# EAGLE design wiring_bord (EAGLE 9.5.2)
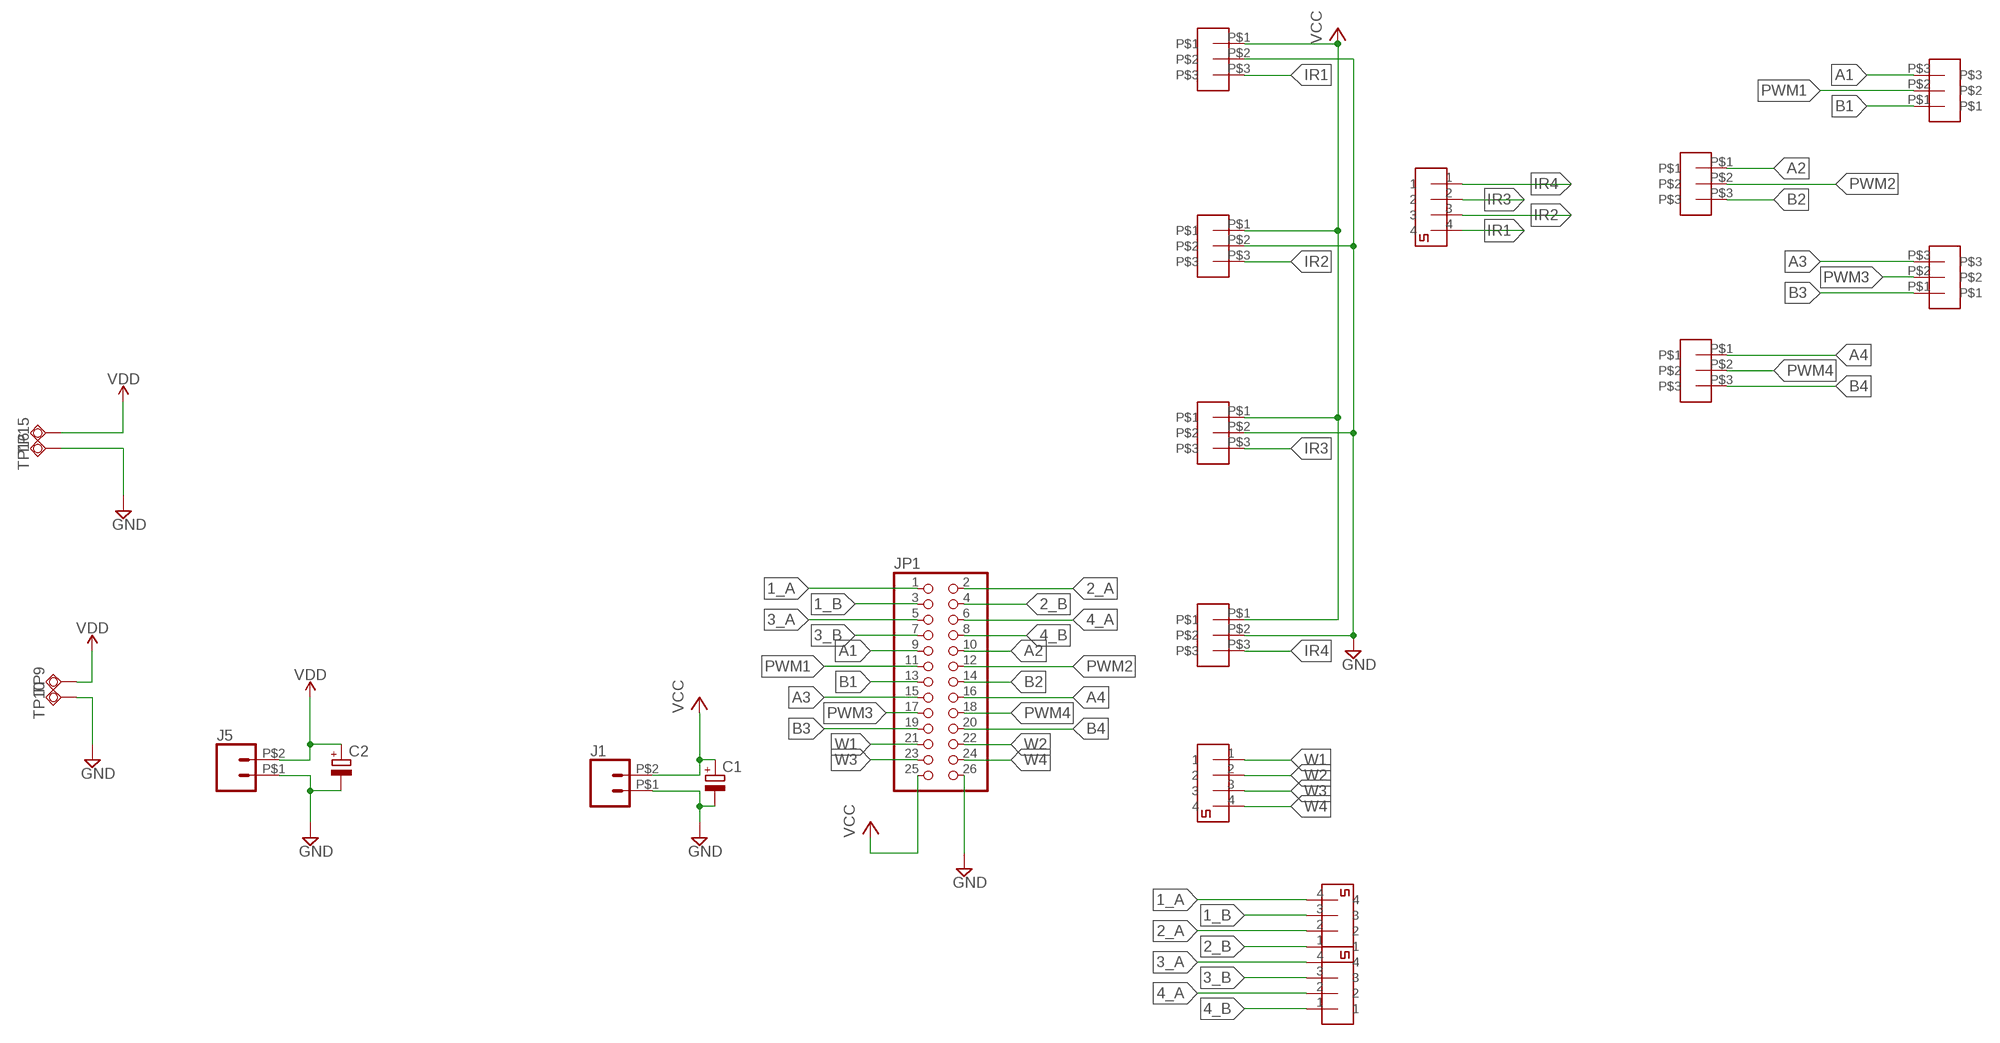
[diagram p0: schematic, sheet 1]

## Parts
C1  CPOL-EUE2-5  [E2-5]
C2  CPOL-EUE2-5  [E2-5]
CONNECTOR1  2PIN  [2PIN]
CONNECTOR2  2PIN  [2PIN]
CONNECTOR3  2PIN  [2PIN]
CONNECTOR4  2PIN  [2PIN]
IR_DISTANCE1  3PIN  [3PIN]
IR_DISTANCE2  3PIN  [3PIN]
IR_DISTANCE3  3PIN  [3PIN]
IR_DISTANCE4  3PIN  [3PIN]
IR_DISTANCE5  3PIN  [3PIN]
IR_DISTANCE6  3PIN  [3PIN]
IR_DISTANCE7  3PIN  [3PIN]
IR_DISTANCE8  3PIN  [3PIN]
J1  CONN_02PTH2  [1X02_BIG]
J5  CONN_02PTH2  [1X02_BIG]
JP1  PINHD-2X13  [2X13]
TP9  TESTPAD_TPSQPAD1-20  [TESTPAD_P1-20]
TP10  TESTPAD_TPSQPAD1-20  [TESTPAD_P1-20]
TP15  TESTPAD_TPSQPAD1-13  [TESTPAD_P1-13]
TP16  TESTPAD_TPSQPAD1-13  [TESTPAD_P1-13]

## Nets
1_A: CONNECTOR3.4 JP1.1
1_B: CONNECTOR3.3 JP1.3
2_A: CONNECTOR3.2 JP1.2
2_B: CONNECTOR3.1 JP1.4
3_A: CONNECTOR4.4 JP1.5
3_B: CONNECTOR4.3 JP1.7
4_A: CONNECTOR4.2 JP1.6
4_B: CONNECTOR4.1 JP1.8
A1: IR_DISTANCE5.P$3 JP1.9
A2: IR_DISTANCE6.P$1 JP1.10
A3: IR_DISTANCE7.P$3 JP1.15
A4: IR_DISTANCE8.P$1 JP1.16
B1: IR_DISTANCE5.P$1 JP1.13
B2: IR_DISTANCE6.P$3 JP1.14
B3: IR_DISTANCE7.P$1 JP1.19
B4: IR_DISTANCE8.P$3 JP1.20
GND: C1.- C2.- IR_DISTANCE1.P$2 IR_DISTANCE2.P$2 IR_DISTANCE3.P$2 IR_DISTANCE4.P$2 J1.P$1 J5.P$1 JP1.26 TP10.TP TP16.TP
IR1: CONNECTOR1.4 IR_DISTANCE1.P$3
IR2: CONNECTOR1.3 IR_DISTANCE2.P$3
IR3: CONNECTOR1.2 IR_DISTANCE3.P$3
IR4: CONNECTOR1.1 IR_DISTANCE4.P$3
PWM1: IR_DISTANCE5.P$2 JP1.11
PWM2: IR_DISTANCE6.P$2 JP1.12
PWM3: IR_DISTANCE7.P$2 JP1.17
PWM4: IR_DISTANCE8.P$2 JP1.18
VCC: C1.+ IR_DISTANCE1.P$1 IR_DISTANCE2.P$1 IR_DISTANCE3.P$1 IR_DISTANCE4.P$1 J1.P$2 JP1.25
VDD: C2.+ J5.P$2 TP9.TP TP15.TP
W1: CONNECTOR2.1 JP1.21
W2: CONNECTOR2.2 JP1.22
W3: CONNECTOR2.3 JP1.23
W4: CONNECTOR2.4 JP1.24

## Library data of the parts
C1 C2 = rcl:CPOL-EU: POLARIZED CAPACITOR, European symbol; SPICEPREFIX: C
CONNECTOR1-CONNECTOR4 = 4pin_small:2PIN: 2pin
IR_DISTANCE1-IR_DISTANCE8 = 3PIN_2:3PIN
J1 J5 = SparkFun-Connectors:CONN_02: Multi connection point. Often used as Generic Header-pin footprint for 0.1 inch spaced/style header connections On any of the 0.1 inch spaced packages, you can populate with these: Break Away Headers - Straight <https://www.sparkfun.com/products/116> (PRT-00116) Break Away Male Headers - Right Angle <https://www.sparkfun.com/products/553> (PRT-00553) Female Headers <https://www.sparkfun.com/products/115> (PRT-00115) Break Away Headers - Machine Pin <https://www.sparkfun.com/products/117> (PRT-00117) Break Away Female Headers - Swiss Machine Pin <https://www.sparkfun.com/products/743> (PRT-00743) For SCREWTERMINALS and SPRING TERMINALS visit here: Screw Terimnals on SparkFun.com <https://www.sparkfun.com/search/results?term=Screw+Terminals> (5mm/3.5mm/2.54mm spacing) This device is also useful as a general connection point to wire up your design to another part of your project. Our various solder wires solder well into these plated through hole pads. Hook-Up Wire - Assortment (Stranded, 22 AWG) <https://www.sparkfun.com/products/11375> (PRT-11375) Hook-Up Wire - Assortment (Solid Core, 22 AWG) <https://www.sparkfun.com/products/11367> (PRT-11367) View the entire wire category on our website here <https://www.sparkfun.com/categories/141> Special notes: Molex polarized connector foot print use with: PRT-08233 with associated crimp pins and housings. 2.54_SCREWTERM for use with PRT-10571. 3.5mm Screw Terminal footprints for PRT-08084 5mm Screw Terminal footprints for use with PRT-08432
JP1 = pinhead:PINHD-2X13: PIN HEADER
TP9 TP10 TP15 TP16 = BeagleBone_Blue_R3:TESTPAD_TPSQ: Test pad

## Board
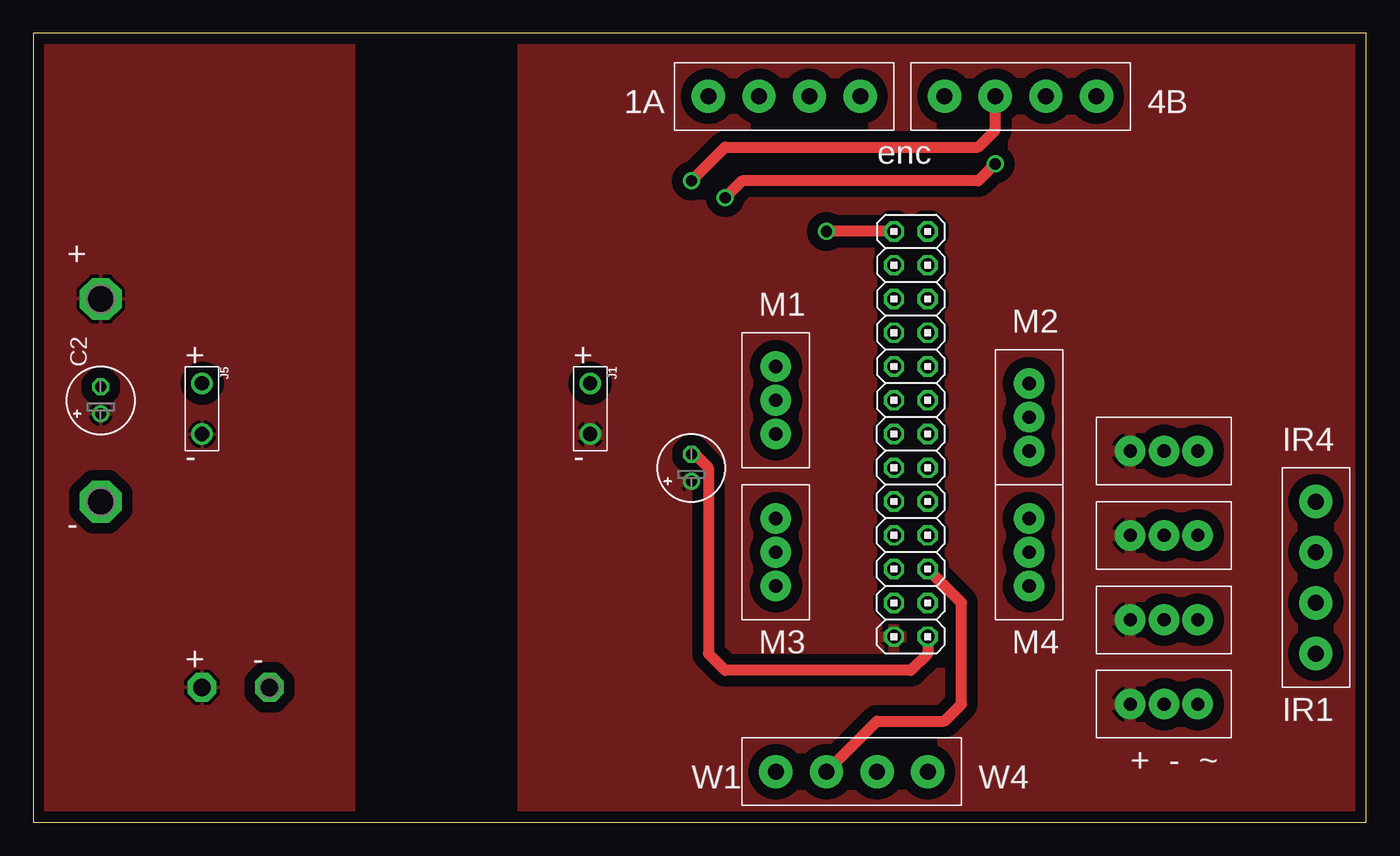
[diagram p1: board, top side]
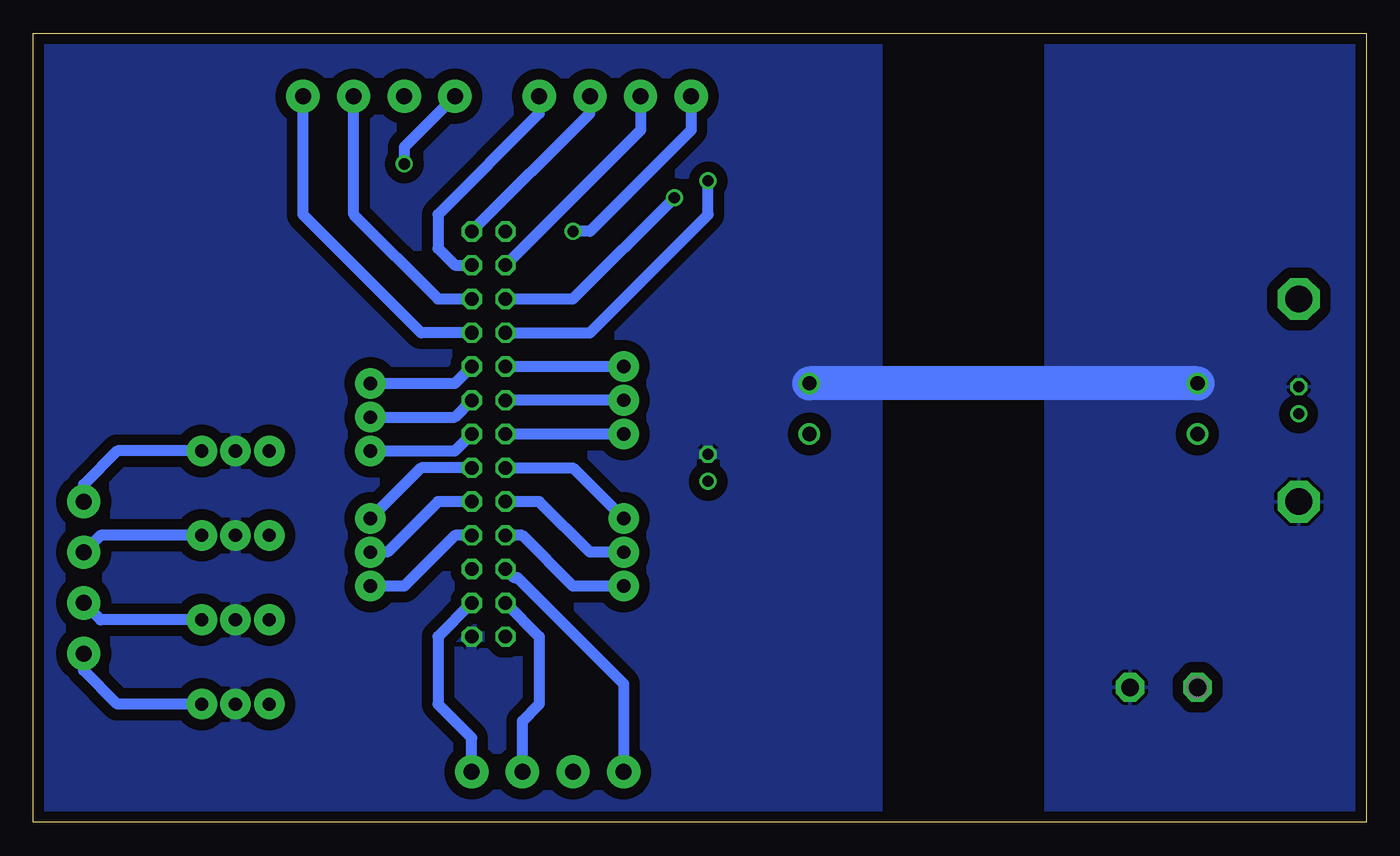
[diagram p2: board, bottom side, seen from below]

Size 100.31 x 59.36 mm. Coordinates in mm from the lower left corner, seen from the top.
Outline: 0,0 100.31,0 100.31,59.36 0,59.36 0,0
Copper layers (1*16): Top 0.035mm / dielectric 1.6mm / Bottom 0.035mm
Design rules "Elecrow_2-layer_PCB_eagle_rule": minimum track width 6mil, minimum drill 12mil, track to track 6mil, track to pad 6mil, pad to pad 6mil, via to via 8mil, smd to smd 0mil, copper to edge 20mil, drill to drill 10mil, minimum pad ring 6mil, minimum via ring 6mil, stop-mask expansion 0mil, vias tented up to drill 100mil, thermal gap 10mil

### Footprints (pad centres in the part's own frame; a part is rotated, then mirrored left to right if it is on the bottom)
E2-5 = drill 0.813 pad 1.27: + -1.016,0 | drill 0.813 pad 1.27 octagon: - 1.016,0
2PIN = drill 1.2 pad 2.5: 1 0,0; 2 3.81,0; 3 7.62,0; 4 11.43,0
3PIN = drill 1 pad 2.3: P$1 0,0; P$2 2.54,0; P$3 5.08,0
1X02_BIG = drill 1.067: P$1 0,0; P$2 3.81,0
2X13 = drill 1.016 octagon: 1 -15.24,-1.27; 2 -15.24,1.27; 3 -12.7,-1.27; 4 -12.7,1.27; 5 -10.16,-1.27; 6 -10.16,1.27; 7 -7.62,-1.27; 8 -7.62,1.27; 9 -5.08,-1.27; 10 -5.08,1.27; 11 -2.54,-1.27; 12 -2.54,1.27; 13 0,-1.27; 14 0,1.27; 15 2.54,-1.27; 16 2.54,1.27; 17 5.08,-1.27; 18 5.08,1.27; 19 7.62,-1.27; 20 7.62,1.27; 21 10.16,-1.27; 22 10.16,1.27; 23 12.7,-1.27; 24 12.7,1.27; 25 15.24,-1.27; 26 15.24,1.27
TESTPAD_P1-20 = drill 2.007 pad 3.15 octagon: TP 0,0
TESTPAD_P1-13 = drill 1.321 pad 2.159 octagon: TP 0,0

### Placement (x,y rotation side)
C1  49.53,26.67 90 top
C2  5.08,31.75 90 top
CONNECTOR1  96.52,12.7 90 top
CONNECTOR2  55.88,3.81 0 top
CONNECTOR3  62.23,54.61 180 top
CONNECTOR4  80.01,54.61 180 top
IR_DISTANCE1  82.55,27.94 0 top
IR_DISTANCE2  82.55,21.59 0 top
IR_DISTANCE3  82.55,15.24 0 top
IR_DISTANCE4  82.55,8.89 0 top
IR_DISTANCE5  55.88,29.21 90 top
IR_DISTANCE6  74.93,33.02 270 top
IR_DISTANCE7  55.88,17.78 90 top
IR_DISTANCE8  74.93,22.86 270 top
J1  41.91,33.02 270 top
J5  12.7,33.02 270 top
JP1  66.04,29.21 270 top
TP9  5.08,39.37 0 top
TP10  5.08,24.13 0 top
TP15  12.7,10.16 0 bottom
TP16  17.78,10.16 0 top

### Tracks (layer width: path | path; a pad name or v marks a point on that pad's centre or on a via)
1_A  (via drill 0.85)
  Top 0.813: JP1.1 v59.69,44.45
  Bottom 0.813: v59.69,44.45 58.42,44.45 50.8,52.07 CONNECTOR3.4
1_B
  Bottom 0.813: JP1.3 54.61,52.07 CONNECTOR3.3
2_A
  Bottom 0.813: CONNECTOR3.2 58.42,53.34 JP1.2
2_B
  Bottom 0.813: CONNECTOR3.1 62.23,53.34 69.85,45.72 69.85,43.18 68.58,41.91 JP1.4
3_A  (via drill 0.85)
  Top 0.813: v72.39,49.53 71.12,48.26 53.34,48.26 v52.07,46.99
  Bottom 0.813: v52.07,46.99 59.69,39.37 JP1.5 | CONNECTOR4.4 72.39,50.8 v72.39,49.53
3_B  (via drill 0.85)
  Top 0.813: v49.53,48.26 52.07,50.8 71.12,50.8 72.39,52.07 CONNECTOR4.3
  Bottom 0.813: JP1.7 58.42,36.83 49.53,45.72 v49.53,48.26
4_A
  Bottom 0.813: JP1.6 69.85,39.37 76.2,45.72 CONNECTOR4.2
4_B
  Bottom 0.813: CONNECTOR4.1 80.01,45.72 71.12,36.83 JP1.8
A1
  Bottom 0.813: IR_DISTANCE5.P$3 JP1.9
A2
  Bottom 0.813: IR_DISTANCE6.P$1 68.58,33.02 JP1.10
A3
  Bottom 0.813: JP1.15 59.69,26.67 IR_DISTANCE7.P$3
A4
  Bottom 0.813: JP1.16 71.12,26.67 IR_DISTANCE8.P$1
B1
  Bottom 0.813: IR_DISTANCE5.P$1 JP1.13
B2
  Bottom 0.813: IR_DISTANCE6.P$3 68.58,27.94 JP1.14
B3
  Bottom 0.813: JP1.19 63.5,21.59 59.69,17.78 IR_DISTANCE7.P$1
B4
  Bottom 0.813: JP1.20 68.58,21.59 72.39,17.78 IR_DISTANCE8.P$3
GND
  Top 0.813: JP1.26 67.31,12.7 66.04,11.43 52.07,11.43 50.8,12.7 50.8,26.67 49.78,27.69 C1.-
  Bottom 2.54: J5.P$1 J1.P$1
  pour Bottom (isolate 0.813): 0,59.69 0,0 24.13,0 24.13,59.69
  pour Bottom (isolate 0.813): 36.83,59.69 36.83,0 100.33,0 100.33,59.69
IR1
  Bottom 0.813: IR_DISTANCE1.P$3 93.98,27.94 96.52,25.4 CONNECTOR1.4
IR2
  Bottom 0.813: IR_DISTANCE2.P$3 95.25,21.59 CONNECTOR1.3
IR3
  Bottom 0.813: IR_DISTANCE3.P$3 95.25,15.24 CONNECTOR1.2
IR4
  Bottom 0.813: IR_DISTANCE4.P$3 93.98,8.89 96.52,11.43 CONNECTOR1.1
PWM1
  Bottom 0.813: IR_DISTANCE5.P$2 JP1.11
PWM2
  Bottom 0.813: JP1.12 68.58,30.48 IR_DISTANCE6.P$2
PWM3
  Bottom 0.813: JP1.17 62.23,24.13 58.42,20.32 IR_DISTANCE7.P$2
PWM4
  Bottom 0.813: JP1.18 69.85,24.13 73.66,20.32 IR_DISTANCE8.P$2
VCC
  pour Top (isolate 0.813): 36.83,59.69 36.83,0 100.33,0 100.33,59.69
VDD
  pour Top (isolate 0.813): 0,59.69 24.13,59.69 24.13,0 0,0
W1
  Bottom 0.813: JP1.21 64.14,18.41 63.87,18.41 55.88,10.42 CONNECTOR2.1
W2
  Top 0.813: JP1.22 69.85,16.51 69.85,8.89 68.58,7.62 63.5,7.62 CONNECTOR2.2
W3
  Bottom 0.813: JP1.23 62.23,13.97 62.23,8.89 63.5,7.62 CONNECTOR2.3
W4
  Bottom 0.813: JP1.24 69.85,13.97 69.85,8.89 67.31,6.35 CONNECTOR2.4

### Text on the board
tNames: 1A | 4B | enc | + | M1 | M2 | + | + | IR4 | - | - | - | M3 | M4 | + | - | IR1 | + - ~ | W1 | W4